# Altium schematic sheet WIRELESS.SchDoc
size 420 x 297 mm; SheetNumber: 29; SheetTotal: 32; DocumentTypeShort: Э3; DocumentInvertoryNumber: ㅤ
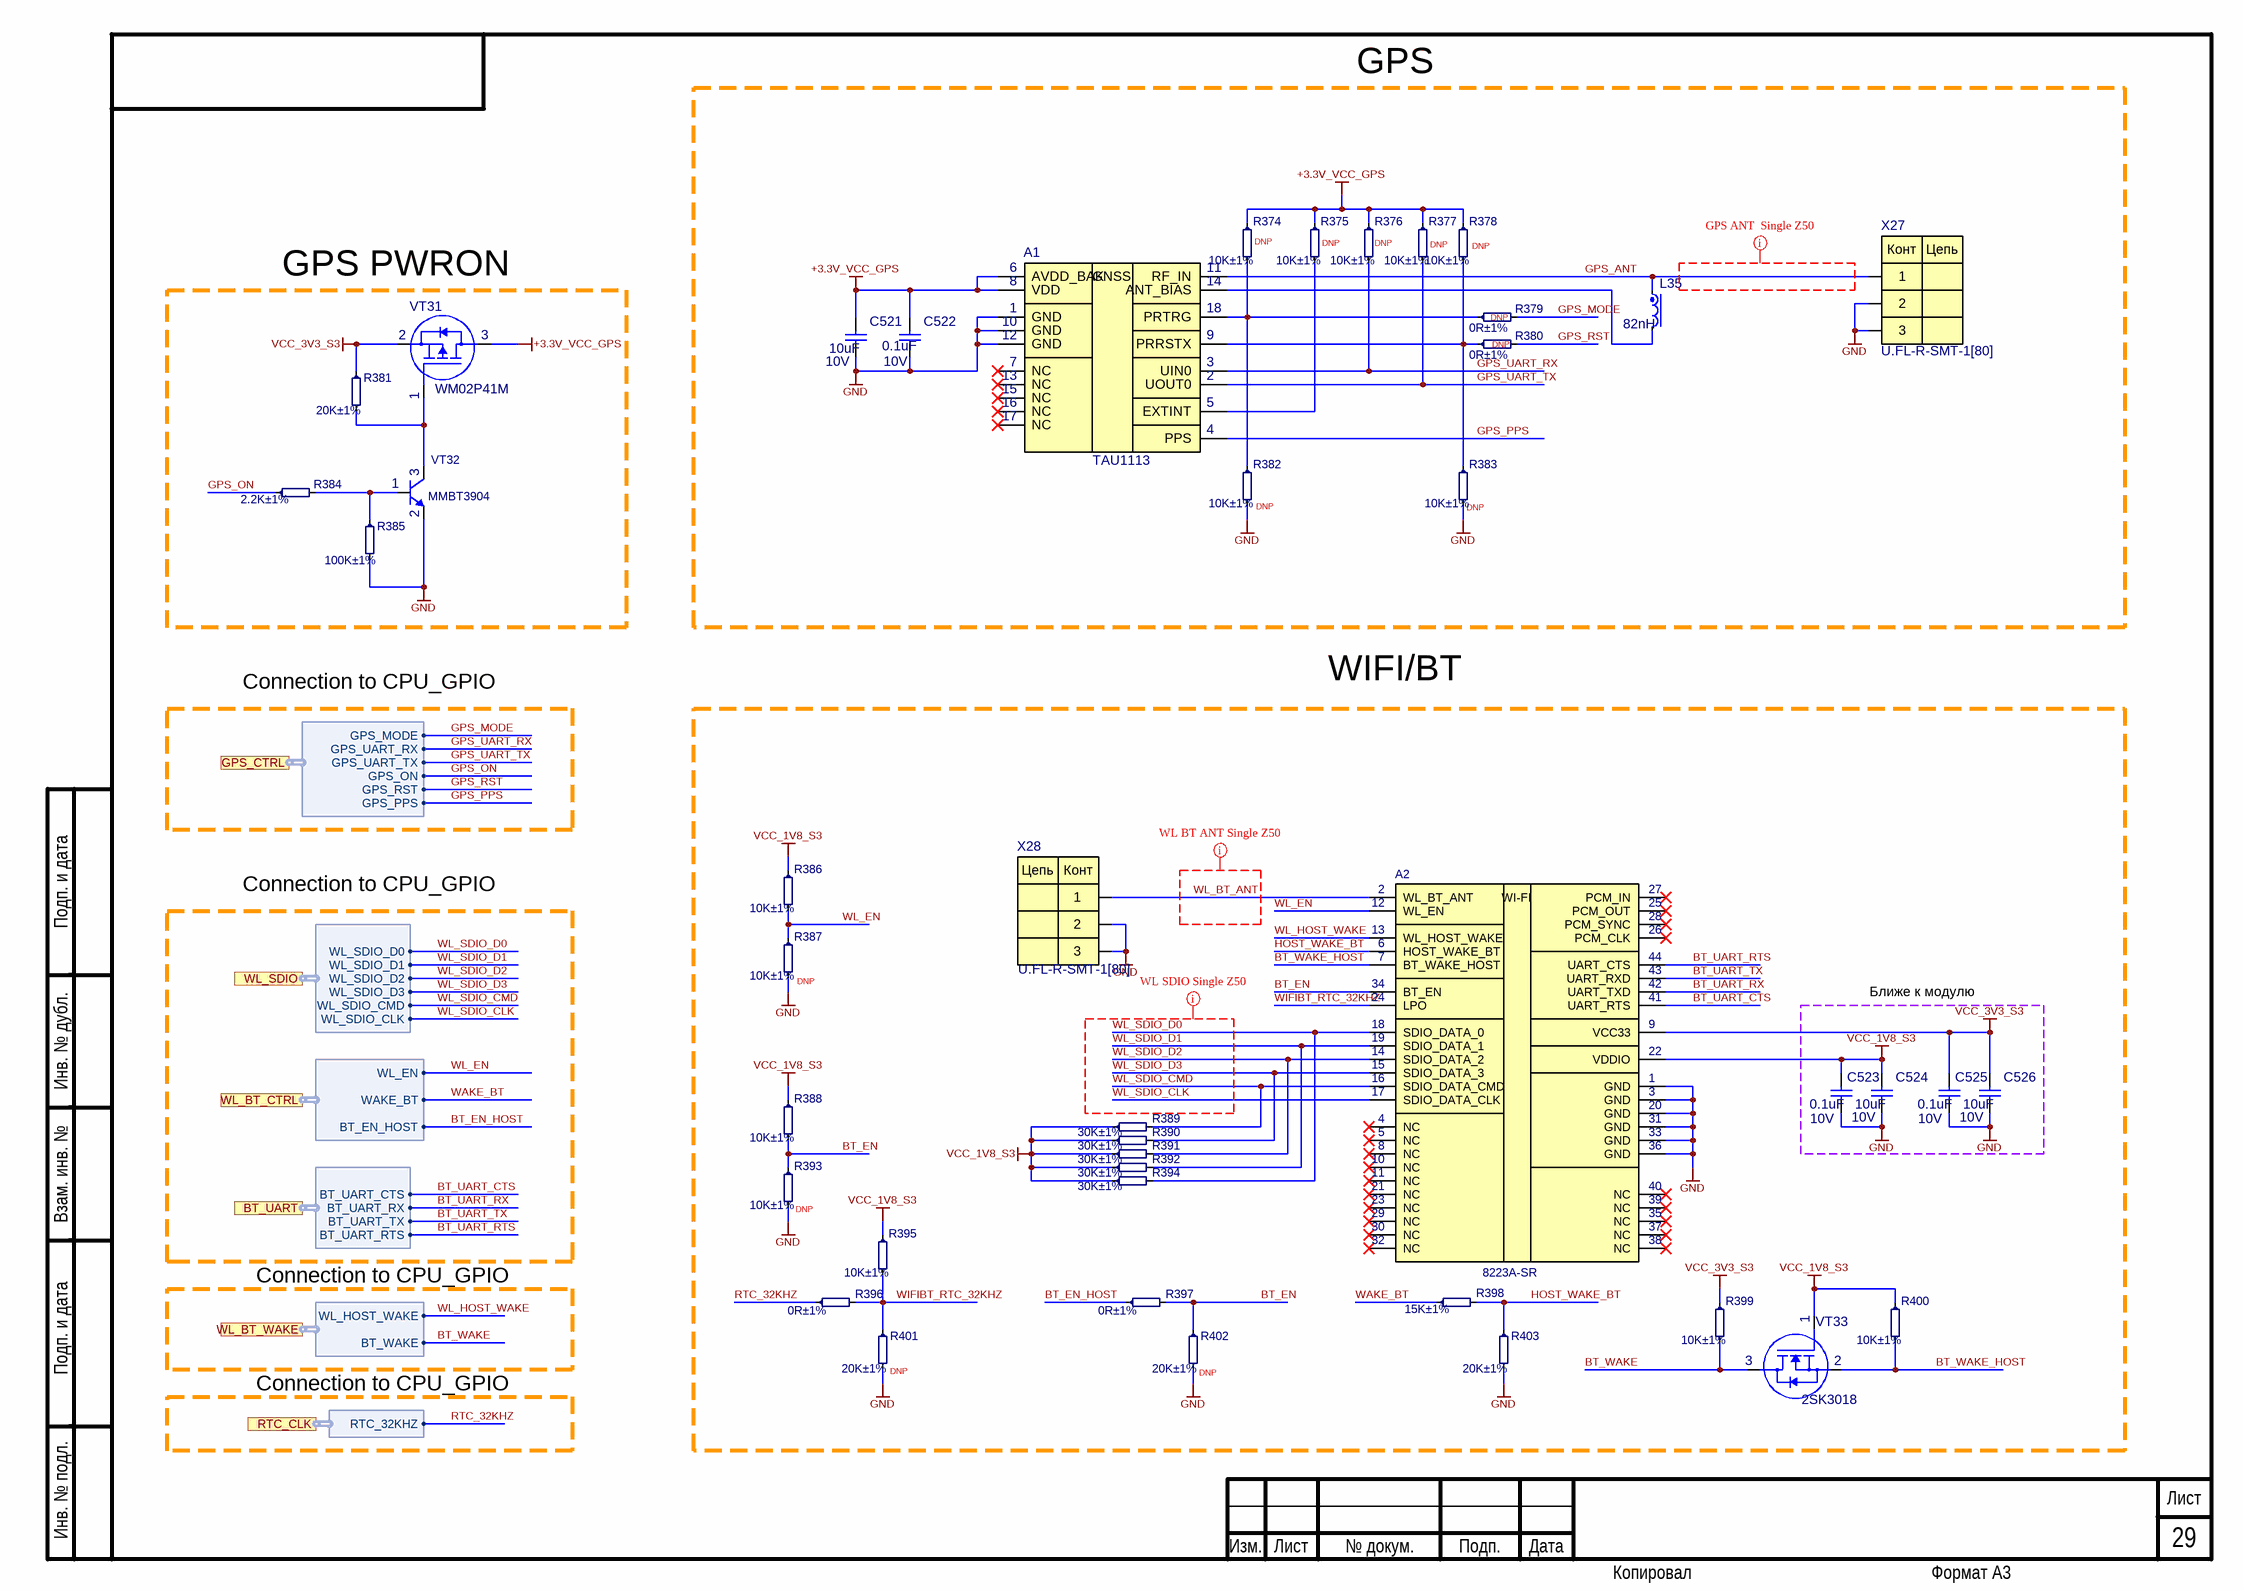
[diagram p0: WIRELESS.SchDoc]

## Parts
A1  TAU1113  [TAU1103]
A2  8223A-SR  [FG6233ASRB-01]
C521  10uF  Voltage: 10V  [C0402]
C522  0.1uF  Voltage: 10V  [C0402]
C523  0.1uF  Voltage: 10V  [C0402]
C524  10uF  Voltage: 10V  [C0402]
C525  0.1uF  Voltage: 10V  [C0402]
C526  10uF  Voltage: 10V  [C0402]
L35  82nH  [L0402]
R374  10K±1%  [R0402]
R375  10K±1%  [R0402]
R376  10K±1%  [R0402]
R377  10K±1%  [R0402]
R378  10K±1%  [R0402]
R379  0R±1%  [R0402]
R380  0R±1%  [R0402]
R381  20K±1%  [R0402]
R382  10K±1%  [R0402]
R383  10K±1%  [R0402]
R384  2.2K±1%  [R0402]
R385  100K±1%  [R0402]
R386  10K±1%  [R0402]
R387  10K±1%  [R0402]
R388  10K±1%  [R0402]
R389  30K±1%  [R0402]
R390  30K±1%  [R0402]
R391  30K±1%  [R0402]
R392  30K±1%  [R0402]
R393  10K±1%  [R0402]
R394  30K±1%  [R0402]
R395  10K±1%  [R0402]
R396  0R±1%  [R0402]
R397  0R±1%  [R0402]
R398  15K±1%  [R0402]
R399  10K±1%  [R0402]
R400  10K±1%  [R0402]
R401  20K±1%  [R0402]
R402  20K±1%  [R0402]
R403  20K±1%  [R0402]
VT31  WM02P41M  [SOT23]
VT32  MMBT3904  [SOT23]
VT33  2SK3018  [2SK3018]
X27  U.FL-R-SMT-1[80]  [1909763-1]
X28  U.FL-R-SMT-1[80]  [1909763-1]

## Blocks framed on the sheet
Ближе к модулю: C523-C526

## Ports
BT_UART (harness BT_UART), GPS_CTRL (harness GPS_CTRL), RTC_CLK (harness RTC_CLK), WL_BT_CTRL (harness WL_BT_CTRL), WL_BT_WAKE (harness WL_BT_WAKE), WL_SDIO (harness WL_SDIO)

## Harnesses
GPS_CTRL: GPS_MODE, GPS_UART_TX, GPS_UART_RX, GPS_ON, GPS_RST, GPS_PPS
WL_SDIO: WL_SDIO_D1, WL_SDIO_D2, WL_SDIO_D3, WL_SDIO_D0, WL_SDIO_CMD, WL_SDIO_CLK
BT_UART: BT_UART_CTS, BT_UART_RX, BT_UART_TX, BT_UART_RTS
RTC_CLK: RTC_32KHZ
WL_BT_WAKE: WL_HOST_WAKE, BT_WAKE
WL_BT_CTRL: WAKE_BT, WL_EN, BT_EN_HOST

## Nets
+3.3V_VCC_GPS: A1.6(AVDD_BAK) A1.8(VDD) C521.2 C522.2 R374.1 R375.1 R376.1 R377.1 R378.1 VT31.3
GND: A1.1(GND) A1.10(GND) A1.12(GND) A2.1(GND) A2.3(GND) A2.20(GND) A2.31(GND) A2.33(GND) A2.36(GND) C521.1 C522.1 C523.1 C524.1 C525.1 C526.1 R382.2 R383.2 R385.2 R387.2 R393.2 R401.2 R402.2 R403.2 VT32.2(E) X27.2 X27.3 X28.2 X28.3
VCC_1V8_S3: A2.22(VDDIO) C523.2 C524.2 R386.1 R388.1 R389.1 R390.1 R391.1 R392.1 R394.1 R395.1 R400.1 VT33.1(G)
VCC_3V3_S3: A2.9(VCC33) C525.2 C526.2 R381.1 R399.1 VT31.2
BT_EN: A2.34(BT_EN) R388.2 R393.1 R397.2 R402.1
BT_EN_HOST: R397.1 ; port WL_BT_CTRL.BT_EN_HOST
BT_UART_CTS: A2.41(UART_RTS) ; port BT_UART.BT_UART_CTS
BT_UART_RTS: A2.44(UART_CTS) ; port BT_UART.BT_UART_RTS
BT_UART_RX: A2.42(UART_TXD) ; port BT_UART.BT_UART_RX
BT_UART_TX: A2.43(UART_RXD) ; port BT_UART.BT_UART_TX
BT_WAKE: R399.2 VT33.3(D) ; port WL_BT_WAKE.BT_WAKE
BT_WAKE_HOST: A2.7(BT_WAKE_HOST) R400.2 VT33.2(S)
GPS_ANT: A1.11(RF_IN) L35.1 X27.1
GPS_MODE: R379.2 ; port GPS_CTRL.GPS_MODE
GPS_ON: R384.1 ; port GPS_CTRL.GPS_ON
GPS_PPS: A1.4(PPS) ; port GPS_CTRL.GPS_PPS
GPS_RST: R380.2 ; port GPS_CTRL.GPS_RST
GPS_UART_RX: A1.3(UIN0) R376.2 ; port GPS_CTRL.GPS_UART_RX
GPS_UART_TX: A1.2(UOUT0) R377.2 ; port GPS_CTRL.GPS_UART_TX
HOST_WAKE_BT: A2.6(HOST_WAKE_BT) R398.2 R403.1
RTC_32KHZ: R396.1 ; port RTC_CLK.RTC_32KHZ
WAKE_BT: R398.1 ; port WL_BT_CTRL.WAKE_BT
WIFIBT_RTC_32KHZ: A2.24(LPO) R395.2 R396.2 R401.1
WL_BT_ANT: A2.2(WL_BT_ANT) X28.1
WL_EN: A2.12(WL_EN) R386.2 R387.1 ; port WL_BT_CTRL.WL_EN
WL_HOST_WAKE: A2.13(WL_HOST_WAKE) ; port WL_BT_WAKE.WL_HOST_WAKE
WL_SDIO_CLK: A2.17(SDIO_DATA_CLK) ; port WL_SDIO.WL_SDIO_CLK
WL_SDIO_CMD: A2.16(SDIO_DATA_CMD) R389.2 ; port WL_SDIO.WL_SDIO_CMD
WL_SDIO_D0: A2.18(SDIO_DATA_0) R394.2 ; port WL_SDIO.WL_SDIO_D0
WL_SDIO_D1: A2.19(SDIO_DATA_1) R392.2 ; port WL_SDIO.WL_SDIO_D1
WL_SDIO_D2: A2.14(SDIO_DATA_2) R391.2 ; port WL_SDIO.WL_SDIO_D2
WL_SDIO_D3: A2.15(SDIO_DATA_3) R390.2 ; port WL_SDIO.WL_SDIO_D3
NetA1_5: A1.5(EXTINT) R375.2
NetA1_9: A1.9(PRRSTX) R378.2 R380.1 R383.1
NetA1_14: A1.14(ANT_BIAS) L35.2
NetA1_18: A1.18(PRTRG) R374.2 R379.1 R382.1
NetR381_2: R381.2 VT31.1 VT32.3(C)
NetR384_2: R384.2 R385.1 VT32.1(B)

Not connected (* = marked no-connect by the designer): A1 7(NC)* 13(NC)* 15(NC)* 16(NC)* 17(NC)*; A2 4(NC)* 5(NC)* 8(NC)* 10(NC)* 11(NC)* 21(NC)* 23(NC)* 25(PCM_OUT)* 26(PCM_CLK)* 27(PCM_IN)* 28(PCM_SYNC)* 29(NC)* 30(NC)* 32(NC)* 35(NC)* 37(NC)* 38(NC)* 39(NC)* 40(NC)*

## Layout directives
net class GPS_ANT: (no net found under the mark)
net class WL BT ANT: WL_BT_ANT
net class WL_SDIO: WL_SDIO_CLK, WL_SDIO_CMD, WL_SDIO_D0, WL_SDIO_D1, WL_SDIO_D2, WL_SDIO_D3

## Notes on the sheet
- GPS
- GPS PWRON
- (near R374) DNP
- (near R375) DNP
- (near R376) DNP
- (near R377) DNP
- (near R378) DNP
- (near R379) DNP
- (near R380) DNP
- (near R382) DNP
- (near R383) DNP
- WIFI/BT
- Connection to CPU_GPIO
- (near R387) DNP
- (near R393) DNP
- (near R401) DNP
- (near R402) DNP
- Подп. и дата
- Инв. № дубл.
- Взам. инв. №
- Инв. № подл.
- Изм.
- Лист
- № докум.
- Подп.
- Дата
- Копировал
- Формат А3
- (in symbol FG6233ASRB-01) WI-FI
- (in symbol FL-R-SMT-1(10)) Конт; Цепь
- (in symbol TAU1103) GNSS

## Library data of the parts
A1 = TAU1103: GNSS Positioning Module; Manufacturer: Allystar; Place: S; Check: False; Part Number: TAU1113; Value: TAU1113; Temperature: -40°C~85°C; ComponentLink1Description: DATASHEET; NameFromManufacturer: TAU1113; ComponentLink1URL: https://www.euromobile.ru/produkciya/glonass-gps-moduli/tau1103/#documents; Datasheet: Datasheets/modules/T-5-2107-TAU1103 Datasheet-V1.4.pdf; Last changed: 27.10.2022
A2 = FG6233ASRB-01: WIFI/BT; Manufacturer: FN-LINK; Place: S; Check: False; Part Number: 8223A-SR; Value: 8223A-SR; Temperature: -40°C~125°C; ComponentLink1Description: DATASHEET; NameFromManufacturer: 8223A-SR; ComponentLink1URL: https://www.fn-link.com/8223A-SR-Wi-Fi-Module-pd47636492.html; Datasheet: #https://rjrorwxhqkkmlr5p-static.micyjz.com/Fn-Link_8223A-SR_datasheet_V1.7_20220527-aidliBplKimloSRljkrmopnip.pdf?dp=#; Last changed: 27.07.2022
C521 = 0402-X5R-10V-10uF±20: *; Manufacturer: Samsung; NameFromManufacturer: CL05A106MP5NUNC; Place: S; Tolerance: 20%; Check: False; Part Number: 0402-X5R-10V-10uF±20; Value: 10uF; Temperature: -55°C~85°C; ComponentLink2Description: Link to datasheet; ComponentLink1Description: DATASHEET; Last changed: 06.04.2023
C522 C523 C525 = 0402-X7R-16V-0.1uF±10%: Part Number: 0402-X5R-10V-0.1uF±10%; Manufacturer: Yageo; NameFromManufacturer: CC0402KRX5R6BB104; Place: S; Tolerance: 10%; Check: False; Value: 0.1uF; Temperature: -55°C~125°C; ComponentLink2Description: Link to datasheet; ComponentLink1Description: DATASHEET; Last changed: 27.10.2022
C524 C526 = 0402-X5R-10V-10uF±20%: *; Manufacturer: Murata Electronics; NameFromManufacturer: GRM155R61A106ME44; Place: S; Tolerance: 20%; Check: False; Part Number: 0402-X5R-10V-10uF±20%; Value: 10uF; Temperature: -55°C~85°C; ComponentLink2Description: Link to datasheet; ComponentLink1Description: DATASHEET; ComponentLink2URL: https://octopart.com/grm155r61a106me44d-murata-99357754?r=sp; ComponentLink1URL: Datasheets/capacitors/GRM155R61A106ME44D.pdf; Last changed: 27.10.2022
L35 = 0402-150mA-82nH±5%: Manufacturer: Murata Electronics; NameFromManufacturer: LQG15HN82NJ02D; Place: S; Tolerance: 5%; Current: 150mA; DC Resistance: 1.6R; Check: False; Analog: MLG1005S82NJT000; Annotation: *; Param: *; Value: 82nH; Part Number: 0402-150mA-82nH±5%; Temperature: -55°C~125°C; ComponentLink1Description: DATASHEET; ComponentLink1URL: https://www.terraelectronica.ru/product/577602; Datasheet: #https://search.murata.co.jp/Ceramy/image/img/P02/JELF243B-0009.pdf#; Last changed: 30.06.2022; ClassName: UART-GPS
R374-R378 R382 R383 R386-R388 R393 R395 R399 R400 = 0402-0.0625W-10K-100ppm±1%: Chip Resistor 0402 10kΩ ±1% 50V ±100ppm/℃ Thick Film; NameFromManufacturer: RC0402FR-0710KL; Manufacturer: Yageo; Place: *); Value: 10K; Check: False; Case: R0402; Part Number: 0402-0.0625W-10K-100ppm±1%; Tolerance: 1%; Temperature: -55°C~155°C; ComponentLink1Description: DATASHEET; ComponentLink1URL: https://ru.mouser.com/ProductDetail/YAGEO/RC0402FR-0710KL?qs=%2Fha2pyFaduhjtLcYvKXQ8IogF7YwN7YtH%252BOO8ZtEEMnoa4yoWYcwpw%3D%3D; Datasheet: Datasheets/resistors/PYu-RC_Group_51_RoHS_L_11.pdf; Last changed: 27.10.2022
R379 R380 R396 R397 = 0402-0.0625W-0R-100ppm±1%: Chip Resistor 0402 0Ω ±1% 50V ±100ppm/℃ Thick Film; NameFromManufacturer: RC0402FR-070RL; Manufacturer: Yageo; Place: *); Value: 0R; Check: False; Case: R0402; Part Number: 0402-0.0625W-0R-100ppm±1%; Tolerance: 1%; Temperature: -55°C~155°C; ComponentLink1Description: DATASHEET; ComponentLink1URL: https://www.chipdip.ru/product0/8000617426?ysclid=l7og5x0plo427794326; Datasheet: Datasheets/resistors/DOC012445956.pdf; Last changed: 27.10.2022
R381 R401-R403 = 0402-0.0625W-20K-100ppm±1%: Chip Resistor 0402 20kΩ ±1% 50V ±100ppm/℃ Thick Film; NameFromManufacturer: RC0402FR-0720KL; Manufacturer: Yageo; Place: *); Value: 20K; Check: False; Case: R0402; Part Number: 0402-0.0625W-20K-100ppm±1%; Tolerance: 1%; Temperature: -55°C~155°C; ComponentLink1Description: DATASHEET; ComponentLink1URL: https://www.terraelectronica.ru/product/506449; Datasheet: Datasheets/resistors/PYu-RC_Group_51_RoHS_L_11.pdf; Last changed: 27.10.2022
R384 = 0402-0.0625W-2.2K-100ppm±1%: *; NameFromManufacturer: RC0402FR-072K2L; Manufacturer: Yageo; Place: *); Value: 2.2K; Tolerance: 1%; Check: False; Case: R0402; Part Number: 0402-0.0625W-2.2K-100ppm±1%; Temperature: -55°C~155°C; ComponentLink1Description: DATASHEET; ComponentLink1URL: https://www.compel.ru/infosheet/YAG/SR0402FR-072K2L; Datasheet: Datasheets/resistors/PYu-SR_D_F tol_RoHS_L_5.pdf; Last changed: 27.10.2022
R385 = 0402-0.0625W-100K-100ppm±1%: Chip Resistor 0402 100kΩ ±1% 50V ±100ppm/℃ Thick Film; NameFromManufacturer: RC0402FR-07100KL; Manufacturer: Yageo; Place: *); Value: 100K; Check: False; Case: R0402; Part Number: 0402-0.0625W-100K-100ppm±1%; Tolerance: 1%; Temperature: -55°C~155°C; ComponentLink1Description: DATASHEET; ComponentLink1URL: https://www.yageo.com/upload/media/product/productsearch/datasheet/rchip/PYu-RC_Group_51_RoHS_L_11.pdf; Datasheet: Datasheets/resistors/PYu-RC_Group_51_RoHS_L_11.pdf; Last changed: 27.10.2022
R389-R392 R394 = 0402-0.0625W-30K-100ppm±1%: NameFromManufacturer: RC0402FR-0730K1L; Manufacturer: Yageo; Place: *); Value: 30K; Tolerance: 1%; Check: False; Case: R0402; Part Number: 0402-0.0625W-30K-100ppm±1%; Temperature: -55°C~155°C; ComponentLink1Description: DATASHEET; ComponentLink1URL: https://www.compel.ru/infosheet/YAG/RC0402FR-0730K1L; Datasheet: Datasheets/resistors/PYu-RC_Group_51_RoHS_L_11.pdf; Last changed: 27.10.2022
R398 = 0402-0.0625W-15K-100ppm±1%: NameFromManufacturer: CR-02FL6---15K; Manufacturer: Viking Tech Corp.(VIKING); Place: *); Value: 15K; Tolerance: 1%; Check: False; Case: R0402; Part Number: 0402-0.0625W-15K-100ppm±1%; Temperature: -55°C~155°C; ComponentLink1Description: DATASHEET; ComponentLink1URL: https://www.terraelectronica.ru/product/2781795; Datasheet: Datasheets/resistors/CR_SERIES.pdf; Last changed: 27.10.2022
VT31 = WM02P41M: Small signal mosfet; Manufacturer: Wayon; Place: S; Voltage: -20V; Check: False; Part Number: WM02P41M; Value: WM02P41M; Temperature: -55°C~150°C; ComponentLink1Description: DATASHEET; NameFromManufacturer: WM02P41M; ComponentLink1URL: https://www.terraelectronica.ru/product/5031341; Datasheet: Datasheets/transistors/UM6K34NTCN.pdf; Last changeв: 27.10.2022
VT32 = MMBT3904: NPN transistor; Manufacturer: Diotec Semiconductor; Place: S; Voltage: 40V; Check: False; Part Number: MMBT3904; Value: MMBT3904; Temperature: -55°C~150°C; ComponentLink1Description: DATASHEET; NameFromManufacturer: MMBT3904; ComponentLink1URL: https://www.terraelectronica.ru/product/607582; Datasheet: Datasheets/transistors/mmbt3904.pdf; Last changeв: 27.10.2022
VT33 = 2SK3018: N-Channel; Manufacturer: KUU; Check: False; Part Number: 2SK3018; Value: 2SK3018; NameFromManufacturer: 2SK3018
X27 X28 = FL-R-SMT-1(10): U.FL-R-SMT-1; Manufacturer: TE Connectivity; Place: S; Check: False; Part Number: U.FL-R-SMT-1[80]; Value: U.FL-R-SMT-1[80]; Temperature: -40°C~90°C; NameFromManufacturer: U.FL-R-SMT-1[80]; Last changed: 27.10.2022
  X28: ComponentLink1Description: DATASHEET; ComponentLink1URL: https://www.te.com/commerce/DocumentDelivery/DDEController?Action=srchrtrv&DocNm=1909763&DocType=Customer+Drawing&DocLang=English